# Altium schematic sheet MotorCtrl.SchDoc
size A3; Revision: C.2
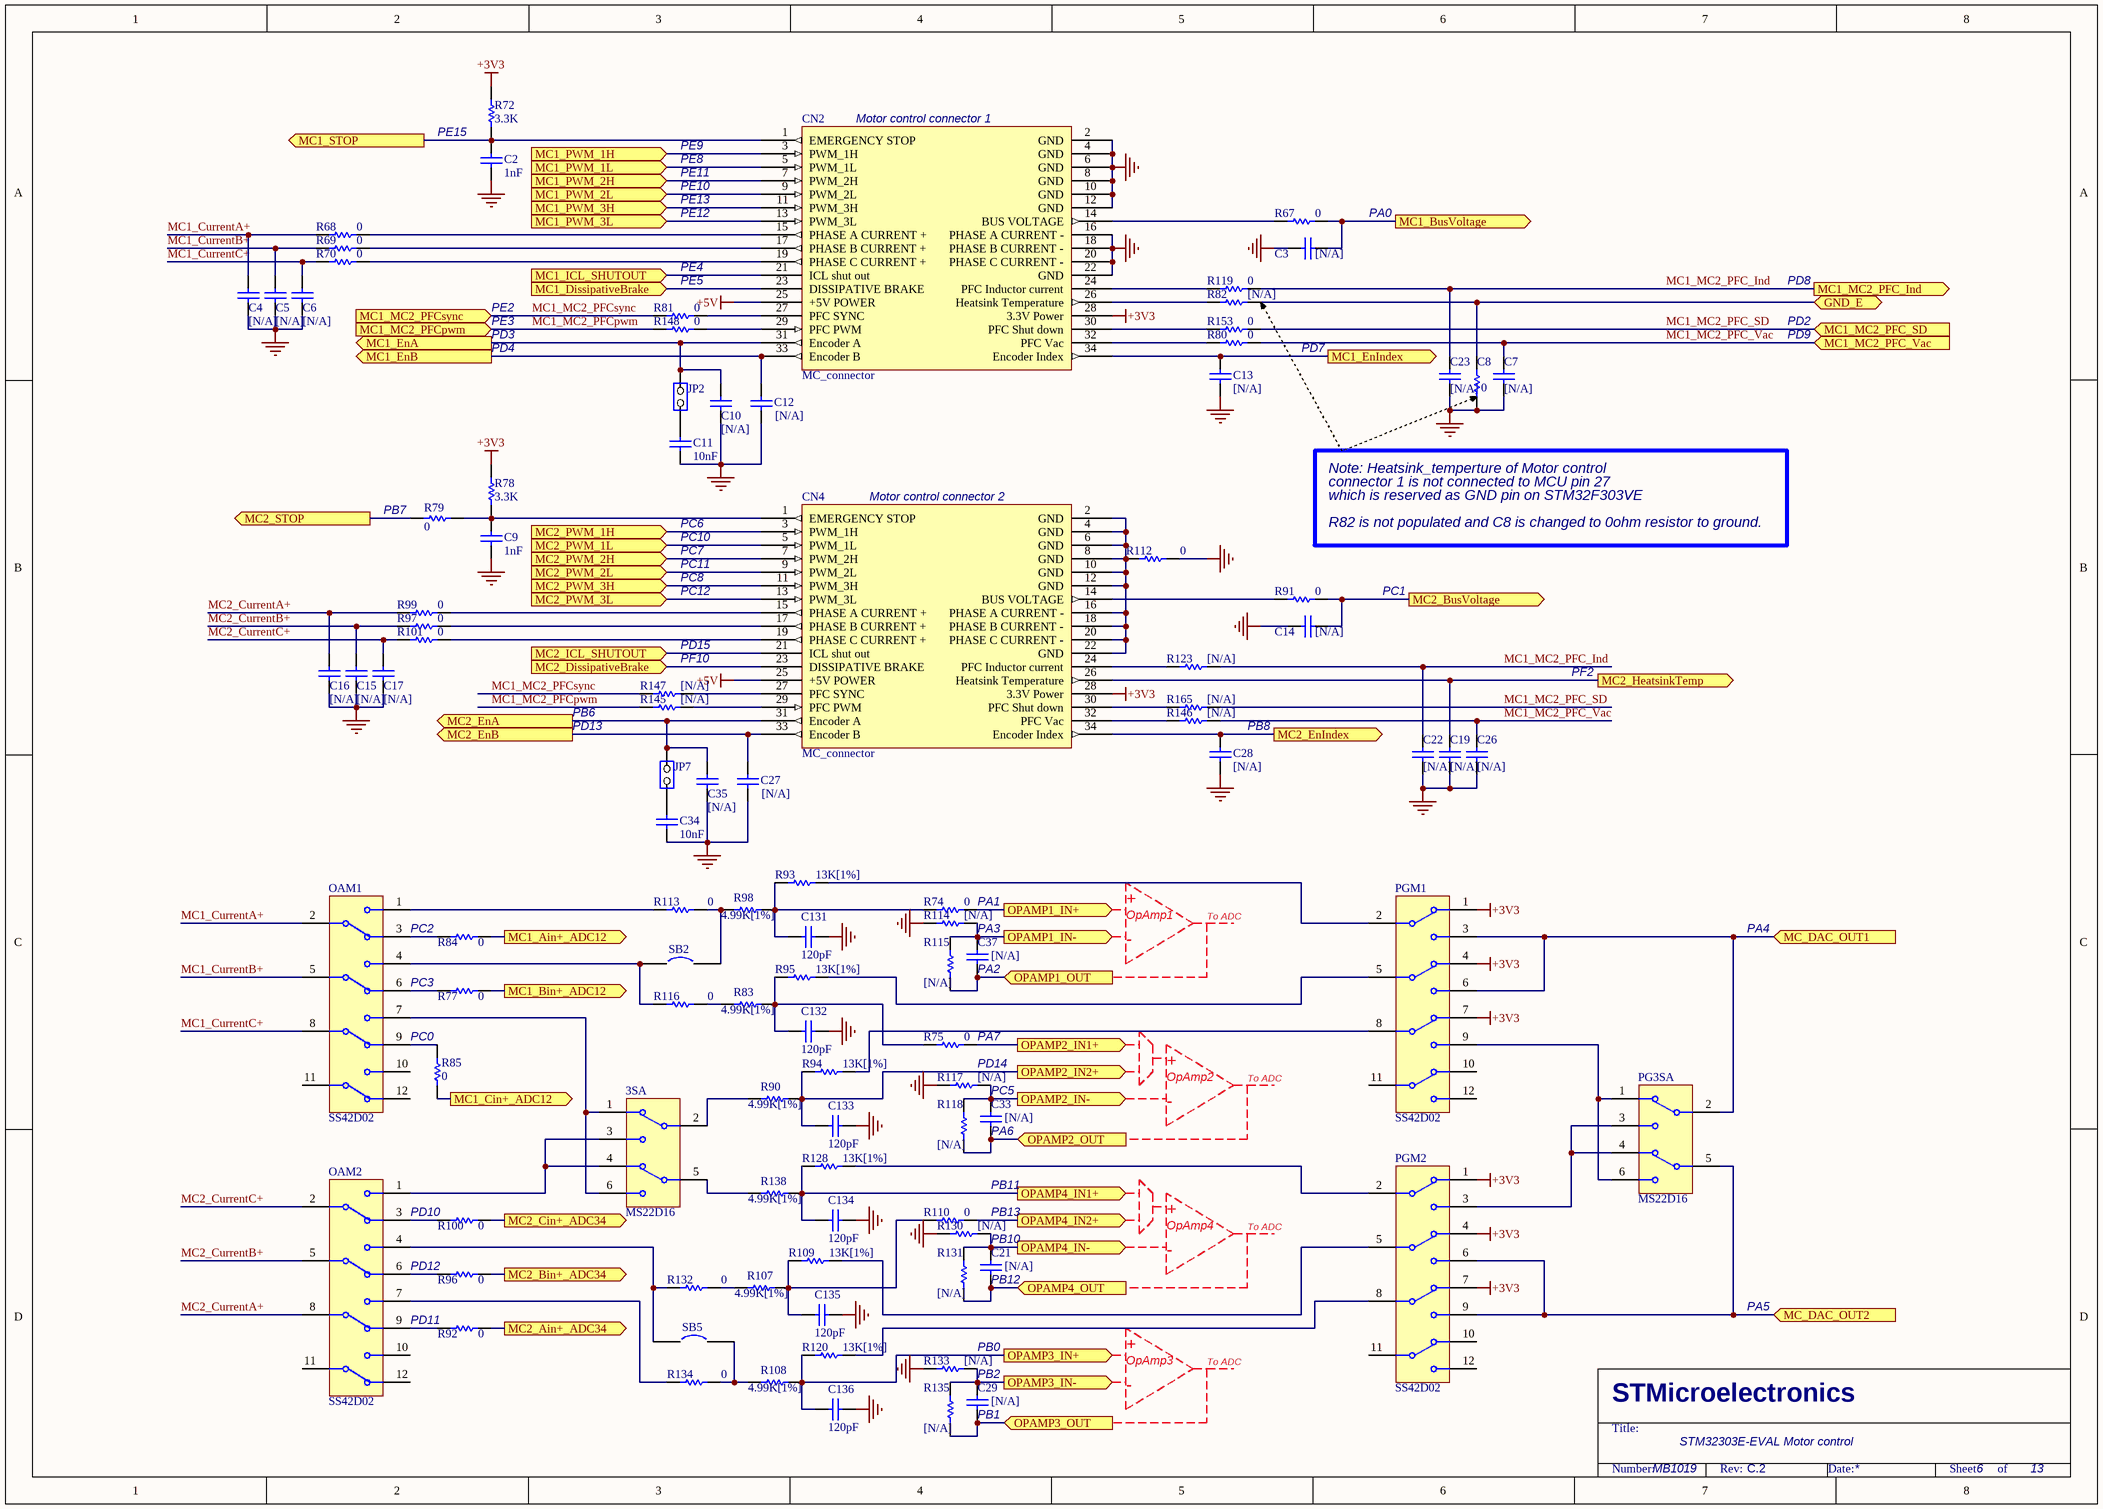
[diagram p0: MotorCtrl.SchDoc]

## Parts
3SA  MS22D16  [MS22D16]
C2  1nF  [0603C]
C3  [N/A]  [0603C]
C4  [N/A]  [0603C]
C5  [N/A]  [0603C]
C6  [N/A]  [0603C]
C7  [N/A]  [0603C]
C8  0  [0603R]
C9  1nF  [0603C]
C10  [N/A]  [0603C]
C11  10nF  [0603C]
C12  [N/A]  [0603C]
C13  [N/A]  [0603C]
C14  [N/A]  [0603C]
C15  [N/A]  [0603C]
C16  [N/A]  [0603C]
C17  [N/A]  [0603C]
C19  [N/A]  [0603C]
C21  [N/A]  [0603C]
C22  [N/A]  [0603C]
C23  [N/A]  [0603C]
C26  [N/A]  [0603C]
C27  [N/A]  [0603C]
C28  [N/A]  [0603C]
C29  [N/A]  [0603C]
C33  [N/A]  [0603C]
C34  10nF  [0603C]
C35  [N/A]  [0603C]
C37  [N/A]  [0603C]
C131  120pF  [0603C]
C132  120pF  [0603C]
C133  120pF  [0603C]
C134  120pF  [0603C]
C135  120pF  [0603C]
C136  120pF  [0603C]
CN2  MC_connector  [IDC34S]
CN4  MC_connector  [IDC34S]
JP2  (no value)  [SIP2]
JP7  (no value)  [SIP2]
OAM1  SS42D02  [SS42D02]
OAM2  SS42D02  [SS42D02]
PG3SA  MS22D16  [MS22D16]
PGM1  SS42D02  [SS42D02]
PGM2  SS42D02  [SS42D02]
R67  0  [0603R]
R68  0  [0603R]
R69  0  [0603R]
R70  0  [0603R]
R72  3.3K  [0603R]
R74  0  [0603R]
R75  0  [0603R]
R77  0  [0603R]
R78  3.3K  [0603R]
R79  0  [0603R]
R80  0  [0603R]
R81  0  [0603R]
R82  [N/A]  [0603R]
R83  4.99K[1%]  [0603R]
R84  0  [0603R]
R85  0  [0603R]
R90  4.99K[1%]  [0603R]
R91  0  [0603R]
R92  0  [0603R]
R93  13K[1%]  [0603R]
R94  13K[1%]  [0603R]
R95  13K[1%]  [0603R]
R96  0  [0603R]
R97  0  [0603R]
R98  4.99K[1%]  [0603R]
R99  0  [0603R]
R100  0  [0603R]
R101  0  [0603R]
R107  4.99K[1%]  [0603R]
R108  4.99K[1%]  [0603R]
R109  13K[1%]  [0603R]
R110  0  [0603R]
R112  0  [0603R]
R113  0  [0603R]
R114  [N/A]  [0603R]
R115  [N/A]  [0603R]
R116  0  [0603R]
R117  [N/A]  [0603R]
R118  [N/A]  [0603R]
R119  0  [0603R]
R120  13K[1%]  [0603R]
R123  [N/A]  [0603R]
R128  13K[1%]  [0603R]
R130  [N/A]  [0603R]
R131  [N/A]  [0603R]
R132  0  [0603R]
R133  [N/A]  [0603R]
R134  0  [0603R]
R135  [N/A]  [0603R]
R138  4.99K[1%]  [0603R]
R145  [N/A]  [0603R]
R146  [N/A]  [0603R]
R147  [N/A]  [0603R]
R148  0  [0603R]
R153  0  [0603R]
R165  [N/A]  [0603R]
SB2  (no value)  [JP2_SMD]
SB5  (no value)  [JP2_SMD]

## Ports
GND_E (bidir), MC1_Ain+_ADC12 (out), MC1_Bin+_ADC12 (out), MC1_BusVoltage (out), MC1_Cin+_ADC12 (out), MC1_DissipativeBrake (in), MC1_EnA (out), MC1_EnB (out), MC1_EnIndex (out), MC1_ICL_SHUTOUT (in), MC1_MC2_PFC_Ind (out), MC1_MC2_PFC_SD (in), MC1_MC2_PFC_Vac (in), MC1_MC2_PFCpwm (in), MC1_MC2_PFCsync (in), MC1_PWM_1H (in), MC1_PWM_1L (in), MC1_PWM_2H (in), MC1_PWM_2L (in), MC1_PWM_3H (in), MC1_PWM_3L (in), MC1_STOP (out), MC2_Ain+_ADC34 (out), MC2_Bin+_ADC34 (out), MC2_BusVoltage (out), MC2_Cin+_ADC34 (out), MC2_DissipativeBrake (in), MC2_EnA (out), MC2_EnB (out), MC2_EnIndex (out), MC2_HeatsinkTemp (out), MC2_ICL_SHUTOUT (in), MC2_PWM_1H (in), MC2_PWM_1L (in), MC2_PWM_2H (in), MC2_PWM_2L (in), MC2_PWM_3H (in), MC2_PWM_3L (in), MC2_STOP (out), MC_DAC_OUT1 (in), MC_DAC_OUT2 (in), OPAMP1_IN+ (out), OPAMP1_IN- (out), OPAMP1_OUT (in), OPAMP2_IN1+ (out), OPAMP2_IN2+ (out), OPAMP2_IN- (out), OPAMP2_OUT (in), OPAMP3_IN+ (out), OPAMP3_IN- (out), OPAMP3_OUT (in), OPAMP4_IN1+ (out), OPAMP4_IN2+ (out), OPAMP4_IN- (out), OPAMP4_OUT (in)

## Nets
+3V3: CN2.28(3.3V_Power) CN4.28(3.3V_Power) PGM1.1 PGM1.4 PGM1.7 PGM2.1 PGM2.4 PGM2.7 R72.2 R78.2
+5V: CN2.25(+5V_POWER) CN4.25(+5V_POWER)
GND: C2.1 C3.2 C4.1 C5.1 C6.1 C7.1 C8.2 C9.1 C10.1 C11.1 C12.1 C13.1 C14.2 C15.1 C16.1 C17.1 C19.1 C22.1 C23.1 C26.1 C27.1 C28.1 C34.1 C35.1 C131.2 C132.2 C133.2 C134.2 C135.2 C136.2 CN2.2(GND) CN2.4(GND) CN2.6(GND) CN2.8(GND) CN2.10(GND) CN2.12(GND) CN2.16(PHASE_A_CURRENT_-) CN2.18(PHASE_B_CURRENT_-) CN2.20(PHASE_C_CURRENT_-) CN2.22(GND) R112.1 R114.1 R117.1 R130.1 R133.1
GND_E: C8.1 R82.2 ; port GND_E
MC1_Ain+_ADC12: R84.1 ; port MC1_Ain+_ADC12
MC1_Bin+_ADC12: R77.1 ; port MC1_Bin+_ADC12
MC1_BusVoltage: C3.1 R67.1 ; port MC1_BusVoltage
MC1_Cin+_ADC12: R85.2 ; port MC1_Cin+_ADC12
MC1_CurrentA+: C4.2 OAM1.2 R68.2
MC1_CurrentB+: C5.2 OAM1.5 R69.2
MC1_CurrentC+: C6.2 OAM1.8 R70.2
MC1_DissipativeBrake: CN2.23(DISSIPATIVE_BRAKE) ; port MC1_DissipativeBrake
MC1_EnA: C10.2 CN2.31(Encoder_A) JP2.1(COMMON) ; port MC1_EnA
MC1_EnB: C12.2 CN2.33(Encoder_B) ; port MC1_EnB
MC1_EnIndex: C13.2 CN2.34(Encoder_Index) ; port MC1_EnIndex
MC1_ICL_SHUTOUT: CN2.21(ICL_shut_out) ; port MC1_ICL_SHUTOUT
MC1_MC2_PFC_Ind: C22.2 C23.2 R119.1 R123.1 ; port MC1_MC2_PFC_Ind
MC1_MC2_PFC_SD: R153.1 R165.1 ; port MC1_MC2_PFC_SD
MC1_MC2_PFC_Vac: C7.2 C26.2 R80.1 R146.1 ; port MC1_MC2_PFC_Vac
MC1_MC2_PFCpwm: R145.2 R148.2 ; port MC1_MC2_PFCpwm
MC1_MC2_PFCsync: R81.2 R147.2 ; port MC1_MC2_PFCsync
MC1_PWM_1H: CN2.3(PWM_1H) ; port MC1_PWM_1H
MC1_PWM_1L: CN2.5(PWM_1L) ; port MC1_PWM_1L
MC1_PWM_2H: CN2.7(PWM_2H) ; port MC1_PWM_2H
MC1_PWM_2L: CN2.9(PWM_2L) ; port MC1_PWM_2L
MC1_PWM_3H: CN2.11(PWM_3H) ; port MC1_PWM_3H
MC1_PWM_3L: CN2.13(PWM_3L) ; port MC1_PWM_3L
MC1_STOP: C2.2 CN2.1(EMERGENCY_STOP) R72.1 ; port MC1_STOP
MC2_Ain+_ADC34: R92.1 ; port MC2_Ain+_ADC34
MC2_Bin+_ADC34: R96.1 ; port MC2_Bin+_ADC34
MC2_BusVoltage: C14.1 R91.1 ; port MC2_BusVoltage
MC2_Cin+_ADC34: R100.1 ; port MC2_Cin+_ADC34
MC2_CurrentA+: C16.2 OAM2.8 R99.2
MC2_CurrentB+: C15.2 OAM2.5 R97.2
MC2_CurrentC+: C17.2 OAM2.2 R101.2
MC2_DissipativeBrake: CN4.23(DISSIPATIVE_BRAKE) ; port MC2_DissipativeBrake
MC2_EnA: C35.2 CN4.31(Encoder_A) JP7.1(COMMON) ; port MC2_EnA
MC2_EnB: C27.2 CN4.33(Encoder_B) ; port MC2_EnB
MC2_EnIndex: C28.2 CN4.34(Encoder_Index) ; port MC2_EnIndex
MC2_HeatsinkTemp: C19.2 CN4.26(Heatsink_Temperature) ; port MC2_HeatsinkTemp
MC2_ICL_SHUTOUT: CN4.21(ICL_shut_out) ; port MC2_ICL_SHUTOUT
MC2_PWM_1H: CN4.3(PWM_1H) ; port MC2_PWM_1H
MC2_PWM_1L: CN4.5(PWM_1L) ; port MC2_PWM_1L
MC2_PWM_2H: CN4.7(PWM_2H) ; port MC2_PWM_2H
MC2_PWM_2L: CN4.9(PWM_2L) ; port MC2_PWM_2L
MC2_PWM_3H: CN4.11(PWM_3H) ; port MC2_PWM_3H
MC2_PWM_3L: CN4.13(PWM_3L) ; port MC2_PWM_3L
MC2_STOP: R79.2 ; port MC2_STOP
MC_DAC_OUT1: PG3SA.2 PGM1.3 PGM1.6 ; port MC_DAC_OUT1
MC_DAC_OUT2: PG3SA.5 PGM2.6 PGM2.9 ; port MC_DAC_OUT2
OPAMP1_IN+: R74.1 ; port OPAMP1_IN+
OPAMP1_IN-: C37.2 R114.2 R115.2 ; port OPAMP1_IN-
OPAMP1_OUT: C37.1 R115.1 ; port OPAMP1_OUT
OPAMP2_IN1+: R75.1 ; port OPAMP2_IN1+
OPAMP2_IN2+: C133.1 R90.2 R94.1 ; port OPAMP2_IN2+
OPAMP2_IN-: C33.2 R117.2 R118.2 ; port OPAMP2_IN-
OPAMP2_OUT: C33.1 R118.1 ; port OPAMP2_OUT
OPAMP3_IN+: C136.1 R108.2 R120.1 ; port OPAMP3_IN+
OPAMP3_IN-: C29.2 R133.2 R135.2 ; port OPAMP3_IN-
OPAMP3_OUT: C29.1 R135.1 ; port OPAMP3_OUT
OPAMP4_IN1+: C134.1 R128.1 R138.2 ; port OPAMP4_IN1+
OPAMP4_IN2+: R110.1 ; port OPAMP4_IN2+
OPAMP4_IN-: C21.2 R130.2 R131.2 ; port OPAMP4_IN-
OPAMP4_OUT: C21.1 R131.1 ; port OPAMP4_OUT
Net3SA_1: 3SA.1 3SA.6 OAM1.7
Net3SA_2: 3SA.2 R90.1
Net3SA_3: 3SA.3 3SA.4 OAM2.1
Net3SA_5: 3SA.5 R138.1
NetC9_2: C9.2 CN4.1(EMERGENCY_STOP) R78.1 R79.1
NetC11_2: C11.2 JP2.2(NO)
NetC34_2: C34.2 JP7.2(NO)
NetC131_1: C131.1 R74.2 R93.1 R98.2
NetC132_1: C132.1 R75.2 R83.2 R95.1
NetC135_1: C135.1 R107.2 R109.1 R110.2
NetCN2_14: CN2.14(BUS_VOLTAGE) R67.2
NetCN2_15: CN2.15(PHASE_A_CURRENT_+) R68.1
NetCN2_17: CN2.17(PHASE_B_CURRENT_+) R69.1
NetCN2_19: CN2.19(PHASE_C_CURRENT_+) R70.1
NetCN2_24: CN2.24(PFC_Inductor_current) R119.2
NetCN2_26: CN2.26(Heatsink_Temperature) R82.1
NetCN2_27: CN2.27(PFC_SYNC) R81.1
NetCN2_29: CN2.29(PFC_PWM) R148.1
NetCN2_30: CN2.30(PFC_Shut_down) R153.2
NetCN2_32: CN2.32(PFC_Vac) R80.2
NetCN4_2: CN4.2(GND) CN4.4(GND) CN4.6(GND) CN4.8(GND) CN4.10(GND) CN4.12(GND) CN4.16(PHASE_A_CURRENT_-) CN4.18(PHASE_B_CURRENT_-) CN4.20(PHASE_C_CURRENT_-) CN4.22(GND) R112.2
NetCN4_14: CN4.14(BUS_VOLTAGE) R91.2
NetCN4_15: CN4.15(PHASE_A_CURRENT_+) R99.1
NetCN4_17: CN4.17(PHASE_B_CURRENT_+) R97.1
NetCN4_19: CN4.19(PHASE_C_CURRENT_+) R101.1
NetCN4_24: CN4.24(PFC_Inductor_current) R123.2
NetCN4_27: CN4.27(PFC_SYNC) R147.1
NetCN4_29: CN4.29(PFC_PWM) R145.1
NetCN4_30: CN4.30(PFC_Shut_down) R165.2
NetCN4_32: CN4.32(PFC_Vac) R146.2
NetOAM1_1: OAM1.1 R113.2
NetOAM1_3: OAM1.3 R84.2
NetOAM1_4: OAM1.4 R116.2 SB2.1
NetOAM1_6: OAM1.6 R77.2
NetOAM1_9: OAM1.9 R85.1
NetOAM2_3: OAM2.3 R100.2
NetOAM2_4: OAM2.4 R132.2 SB5.1
NetOAM2_6: OAM2.6 R96.2
NetOAM2_7: OAM2.7 R134.2
NetOAM2_9: OAM2.9 R92.2
NetPG3SA_1: PG3SA.1 PG3SA.6 PGM1.9
NetPG3SA_3: PG3SA.3 PG3SA.4 PGM2.3
NetPGM1_2: PGM1.2 R93.2
NetPGM1_5: PGM1.5 R95.2
NetPGM1_8: PGM1.8 R94.2
NetPGM2_2: PGM2.2 R128.2
NetPGM2_5: PGM2.5 R109.2
NetPGM2_8: PGM2.8 R120.2
NetR83_1: R83.1 R116.1
NetR98_1: R98.1 R113.1 SB2.2
NetR107_1: R107.1 R132.1
NetR108_1: R108.1 R134.1 SB5.2

Not connected (* = marked no-connect by the designer): OAM1 10 11 12; OAM2 10 11 12; PGM1 10 11 12; PGM2 10 11 12

## Notes on the sheet
- PE15
- PE9
- PE8
- PE11
- (near CN2) Motor control connector 1
- PE10
- PE13
- PE12
- PA0
- PE2
- PE5
- PE4
- PD8
- PD3
- PD4
- PE3
- PD7
- PD2
- PD9
- (near R79) PB7
- (near CN4) Motor control connector 2
- Note: Heatsink_temperture of Motor control
- which is reserved as GND pin on STM32F303VE
- connector 1 is not connected to MCU pin 27
- PC6
- PC10
- PC7
- PC11
- PC8
- R82 is not populated and C8 is changed to 0ohm resistor to ground.
- PC12
- PD15
- PC1
- PB6
- PF10
- PF2
- PD13
- PB8
- PA1
- +
- OpAmp1
- To ADC
- PC2
- PC3
- PA3
- (near C37) PA2
- -
- PA4
- PC0
- (near R75) PA7
- PD14
- PC5
- OpAmp2
- (near C33) PA6
- PB11
- PD10
- PB13
- PB10
- OpAmp4
- PD12
- PD11
- (near C21) PB12
- PA5
- (near R133) PB0
- PB2
- OpAmp3
- (near C29) PB1
- STM32303E-EVAL Motor control
- MB1019
- 6
- 13
- STMicroelectronics
- Title:
- Number:
- Rev:
- Date:
- Sheet       of

## Library data of the parts
3SA PG3SA = MS22D16: DPDT; Revision 1: Jul-2002: Re-released for DXP Platform.; Revision 2: 17-Dec-2003: Schematic revised, PCB Footprint replaced.; Published: 24-Mar-1999; Datasheet: Latest Revision: 05-Dec-2000; Publisher: Altium Limited
C2 C9 = CAP: Capacitor; Value: 100pF; Published: 8-Jun-2000; Revision: July-2002: Re-released for DXP Platform.; Publisher: Altium Limited
C3-C7 C10-C17 C19 C21-C23 C26-C29 C33-C35 C37 C131-C136 = cap: Capacitor; Value: 100pF; Published: 8-Jun-2000; Revision: July-2002: Re-released for DXP Platform.; Publisher: Altium Limited
C8 R67-R70 R72 R74 R75 R77-R85 R90-R101 R107-R110 R112-R120 R123 R128 R130-R135 R138 R145-R148 R153 R165 = Res1: Resistor; Value: 1K; Published: 8-Jun-2000; Revision: July-2002: Re-released for DXP Platform.; Publisher: Altium Limited
CN2 CN4 = MC_connector_1
JP2 JP7 = JP2
OAM1 OAM2 = SS42D02_1: SPDT Subminiature Toggle Switch, Right Angle Mounting, Vertical Actuation; Revision 1: Jul-2002: Re-released for DXP Platform.; Revision 2: 17-Dec-2003: Schematic revised, PCB Footprint replaced.; Published: 24-Mar-1999; Datasheet: Latest Revision: 05-Dec-2000; Publisher: Altium Limited
PGM1 PGM2 = SS42D02: SPDT Subminiature Toggle Switch, Right Angle Mounting, Vertical Actuation; Revision 1: Jul-2002: Re-released for DXP Platform.; Revision 2: 17-Dec-2003: Schematic revised, PCB Footprint replaced.; Published: 24-Mar-1999; Datasheet: Latest Revision: 05-Dec-2000; Publisher: Altium Limited
SB2 SB5 = Circuit Breaker: Published: 24-Mar-1999; Revision: July-2002: Re-released for DXP Platform.; Publisher: Altium Limited